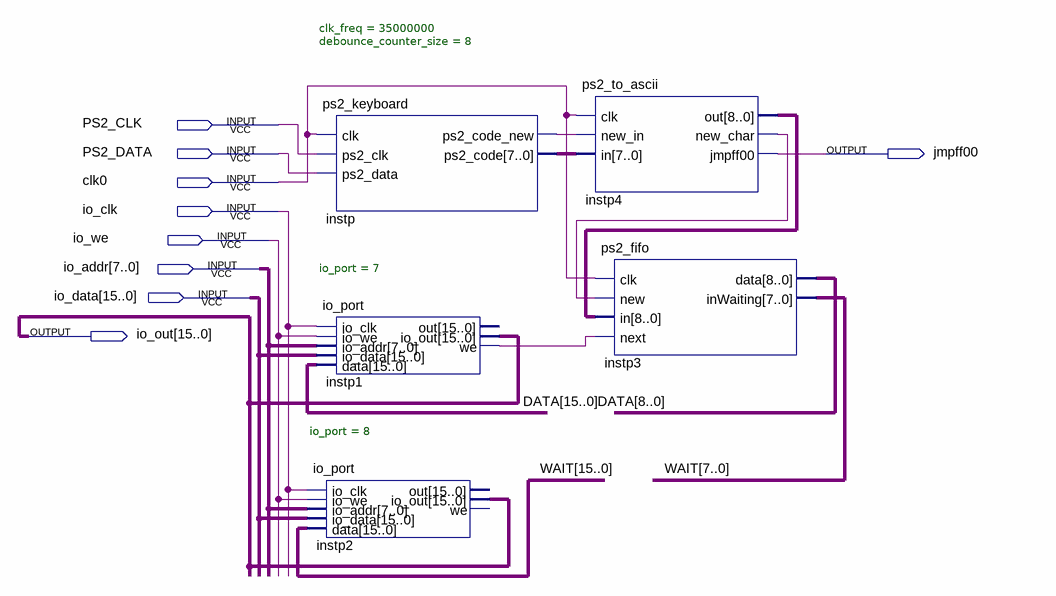
[diagram p0: schematic sheet]
// Quartus schematic ps2_io.bdf as structural Verilog: 5 symbols, 9 pins
module ps2_io (
  input  PS2_CLK,
  input  PS2_DATA,
  input  clk0,
  input  io_clk,
  input  io_we,
  input  [7:0] io_addr,
  input  [15:0] io_data,
  output jmpff00,
  output [15:0] io_out
);

  wire instp1_we, instp4_new_char, instp_ps2_code_new;
  wire [7:0] instp_ps2_code;
  wire [8:0] instp4_out;
  wire [15:0] DATA, WAIT;

  io_port #(.io_port(8)) instp2 (
    .io_clk(io_clk), .io_we(io_we), .io_addr(io_addr), .io_data(io_data), .data(WAIT), .io_out(io_out));  // open: out, we
  ps2_keyboard #(.clk_freq(35000000), .debounce_counter_size(8)) instp (
    .clk(clk0), .ps2_clk(PS2_CLK), .ps2_data(PS2_DATA), .ps2_code_new(instp_ps2_code_new),
    .ps2_code(instp_ps2_code));
  io_port #(.io_port(7)) instp1 (
    .io_clk(io_clk), .io_we(io_we), .io_addr(io_addr), .io_data(io_data), .data(DATA), .io_out(io_out),
    .we(instp1_we));  // open: out
  ps2_to_ascii instp4 (
    .clk(clk0), .new_in(instp_ps2_code_new), .in(instp_ps2_code), .out(instp4_out),
    .new_char(instp4_new_char), .jmpff00(jmpff00));
  ps2_fifo instp3 (
    .clk(clk0), .\new (instp4_new_char), .in(instp4_out), .next(instp1_we), .data(DATA[8:0]),
    .inWaiting(WAIT[7:0]));
endmodule
